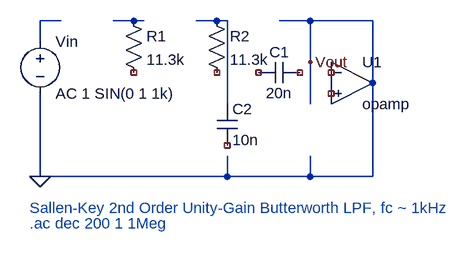
[diagram p0: schematic sallen_key_lpf.asc]
sallen_key_lpf.asc, the LTspice schematic file:
Version 4
SHEET 1 880 680
WIRE 96 112 64 112
WIRE 224 112 176 112
WIRE 352 112 304 112
WIRE 352 176 352 112
WIRE 480 112 432 112
WIRE 576 112 480 112
WIRE 480 176 480 112
WIRE 64 144 64 112
WIRE 352 240 352 176
WIRE 480 240 480 176
WIRE 576 240 576 112
WIRE 64 240 64 224
WIRE 352 352 352 320
WIRE 480 352 480 320
WIRE 480 352 352 352
WIRE 64 352 64 240
WIRE 64 352 352 352
WIRE 576 352 576 240
WIRE 576 352 480 352
FLAG 64 352 0
FLAG 480 176 Vout
SYMBOL voltage 64 128 R0
WINDOW 123 0 0 Left 0
WINDOW 39 0 0 Left 0
SYMATTR InstName Vin
SYMATTR Value AC 1 SIN(0 1 1k)
SYMBOL res 192 96 R0
SYMATTR InstName R1
SYMATTR Value 11.3k
SYMBOL res 320 96 R0
SYMATTR InstName R2
SYMATTR Value 11.3k
SYMBOL cap 336 240 R0
SYMATTR InstName C2
SYMATTR Value 10n
SYMBOL cap 464 176 R90
WINDOW 0 0 32 VBottom 2
WINDOW 3 32 32 VTop 2
SYMATTR InstName C1
SYMATTR Value 20n
SYMBOL OpAmps\\opamp 544 144 R0
SYMATTR InstName U1
TEXT 48 400 Left 2 ;Sallen-Key 2nd Order Unity-Gain Butterworth LPF, fc ~ 1kHz
TEXT 48 424 Left 2 ;.ac dec 200 1 1Meg

The netlist it stands for:
* sallen_key_lpf.asc
Vin N001 0 AC 1 SIN(0 1 1k)
R1 N002 NC_01 11.3k
R2 N003 NC_02 11.3k
C2 N003 NC_03 10n
C1 NC_04 NC_05 20n
XU1 NC_06 NC_07 0 opamp Aol=100K GBW=10Meg  ; pins invin noninvin out
* Sallen-Key 2nd Order Unity-Gain Butterworth LPF, fc ~ 1kHz
* .ac dec 200 1 1Meg
.backanno
.end